# EAGLE design thesis (EAGLE 6.4)
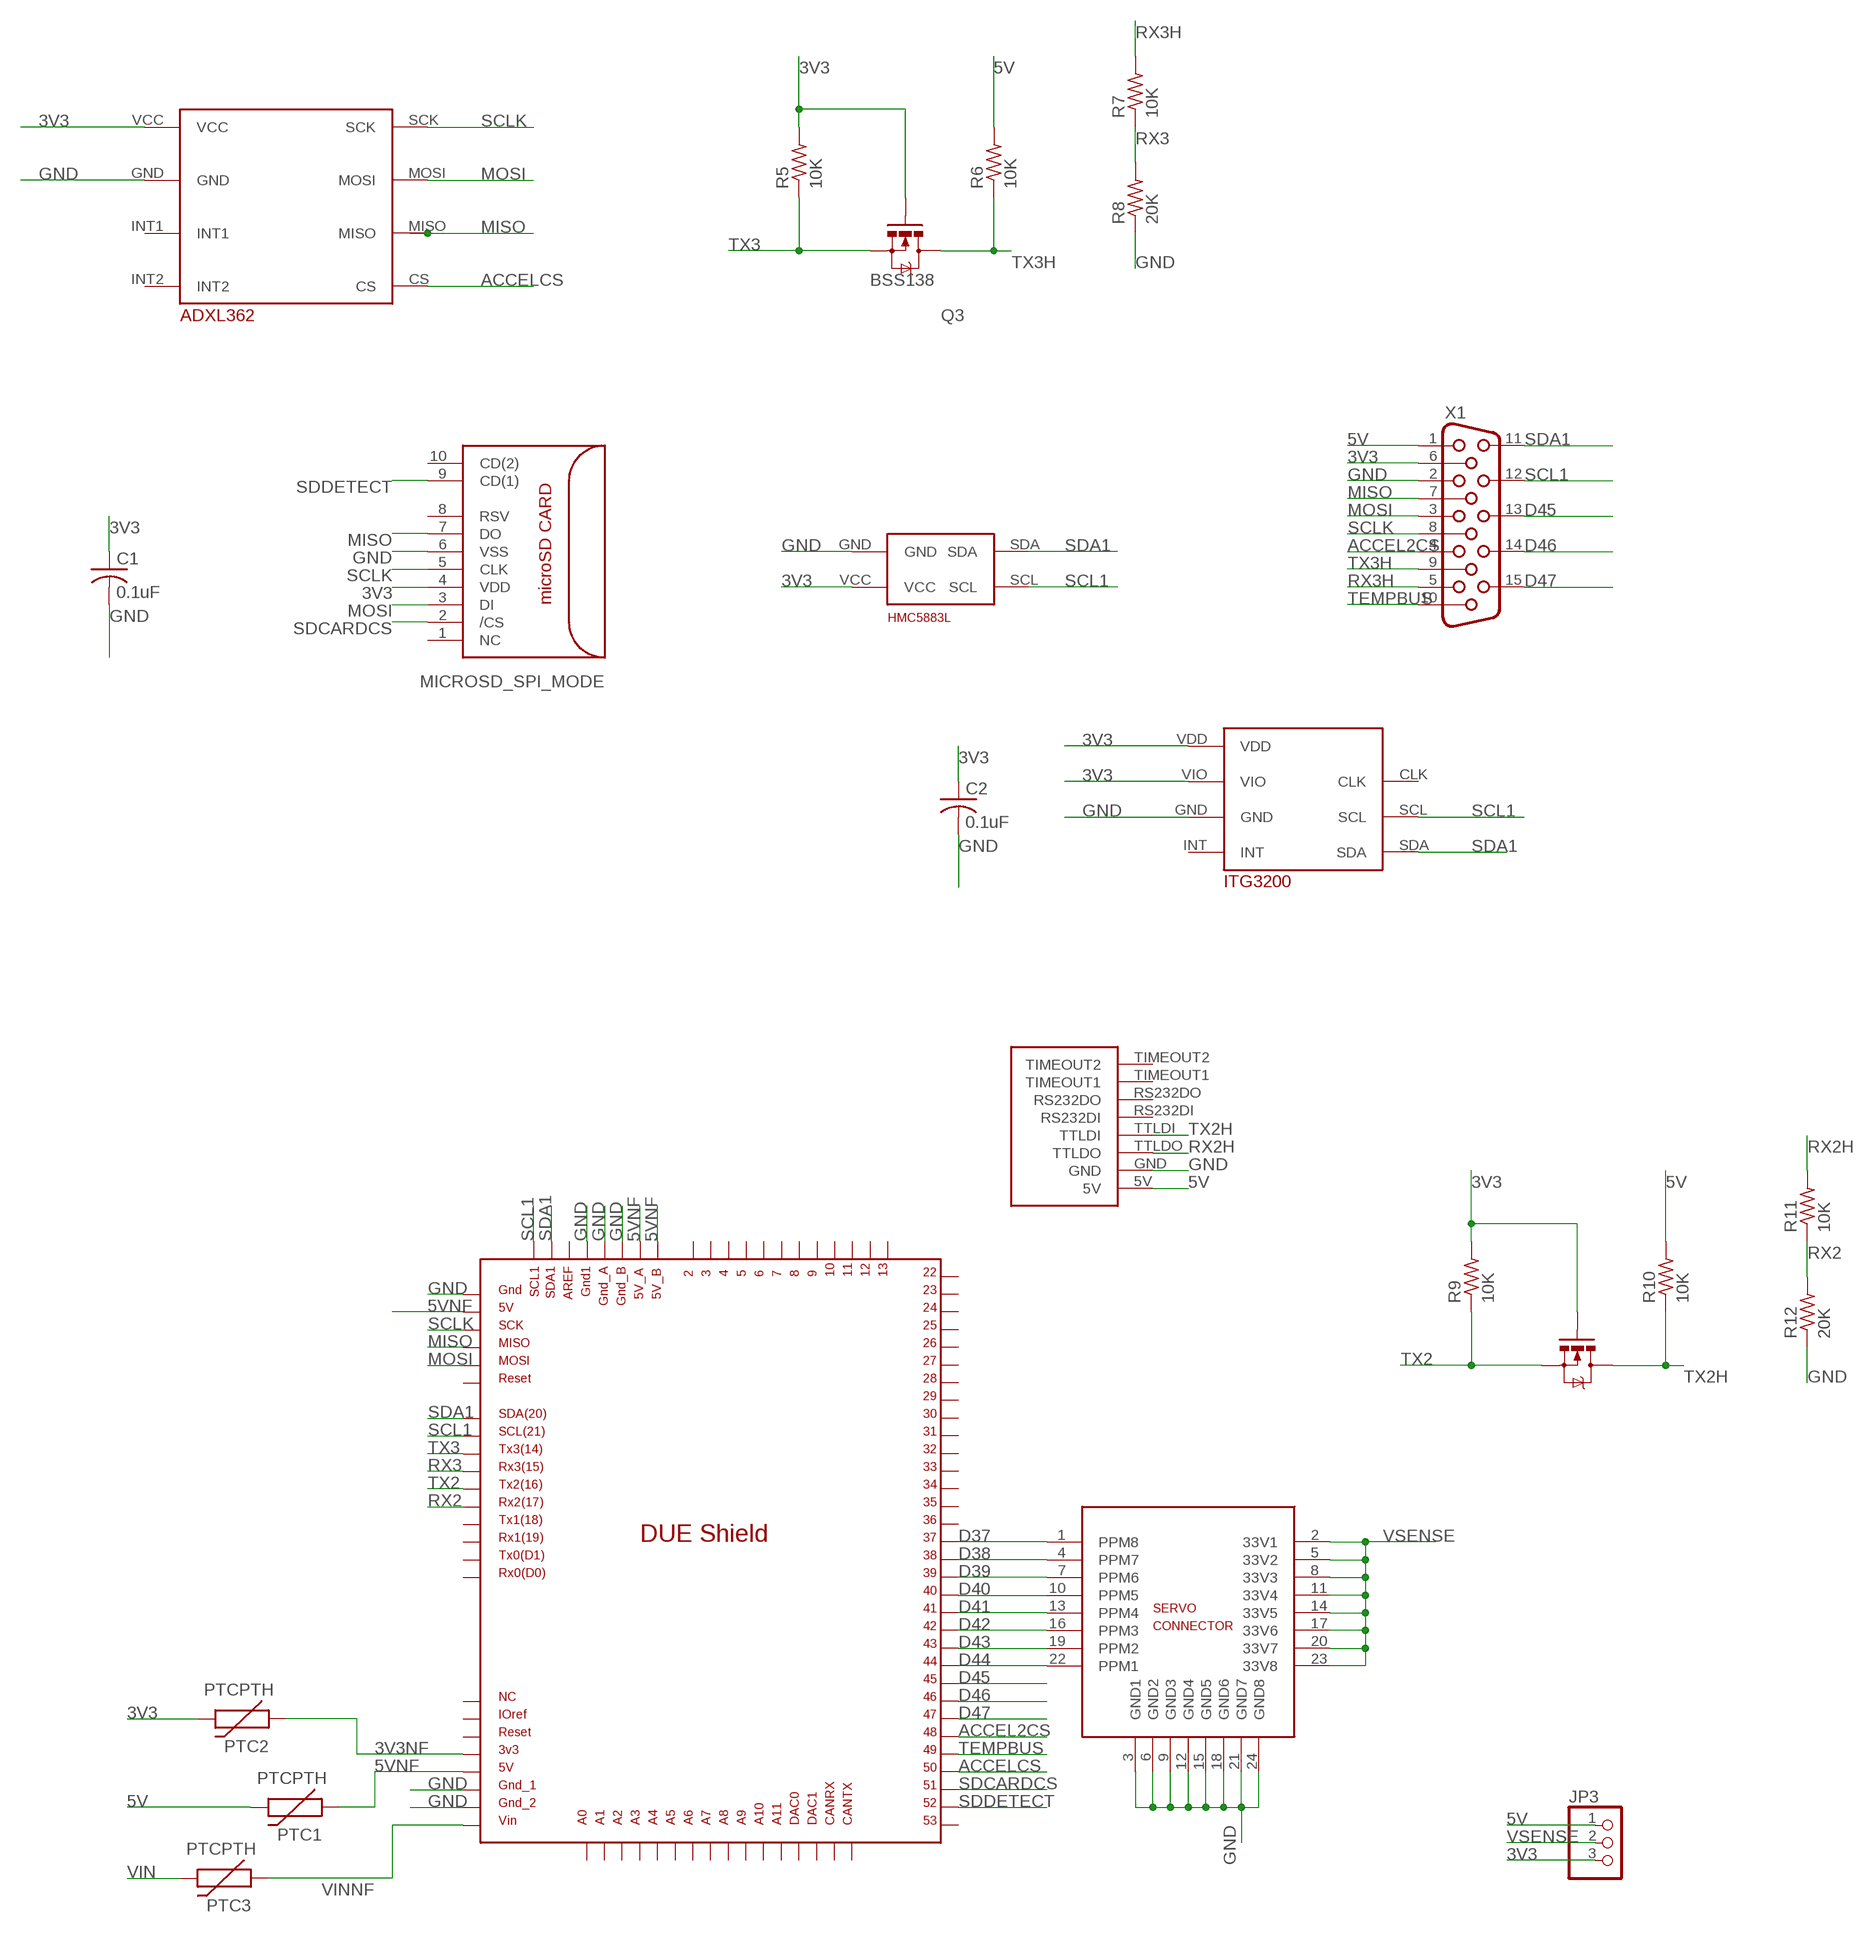
[diagram p0: schematic, sheet 1]

## Parts
C1  0.1uF  C-USC0603  [C0603]
C2  0.1uF  C-USC0603  [C0603]
JP3  PINHD-1X3  [1X03]
PTC1  PTCPTH  [PTC]
PTC2  PTCPTH  [PTC]
PTC3  PTCPTH  [PTC]
Q1  BSS138  MOSFET-NCHANNELBSS123LT1G  [SOT23]
Q3  BSS138  MOSFET-NCHANNELBSS123LT1G  [SOT23]
R5  10K  R-US_R0603  [R0603]
R6  10K  R-US_R0603  [R0603]
R7  10K  R-US_R0603  [R0603]
R8  20K  R-US_R0603  [R0603]
R9  10K  R-US_R0603  [R0603]
R10  10K  R-US_R0603  [R0603]
R11  10K  R-US_R0603  [R0603]
R12  20K  R-US_R0603  [R0603]
U$1  DUE(NORMAL)  [DUE(NORMAL)]
U$2  MICROSD_SPI_MODE  [MICRO_SD_CONNECTOR]
U$4  HMC5883L  [HMC5883L]
U$5  HEADER-3X8SERVO  [3X8RA]
U$6  UBLOXLEA6TBOB  [UBLOXLEA6TBOB]
U$7  ITG3200  [ITG3200]
U$8  ADXL362  [ADXL362]
X1  HF15V  [HDF15V]

## Nets
3V3: C1.1 C2.1 JP3.3 PTC2.P$2 Q1.1(G) Q3.1(G) R5.2 R9.2 U$2.4(VDD) U$4.VCC U$7.VDD U$7.VIO U$8.VCC X1.6
3V3NF: PTC2.P$1 U$1.3V3
5V: JP3.1 PTC1.P$2 R6.2 R10.2 U$6.5V X1.1
5VNF: PTC1.P$1 U$1.5V U$1.5V_A U$1.5V_B U$1.GND_ICSP
ACCEL2CS: U$1.48 X1.4
ACCELCS: U$1.50 U$8.CS
D37: U$1.37 U$5.1(PPM8)
D38: U$1.38 U$5.4(PPM7)
D39: U$1.39 U$5.7(PPM6)
D40: U$1.40 U$5.10(PPM5)
D41: U$1.41 U$5.13(PPM4)
D42: U$1.42 U$5.16(PPM3)
D43: U$1.43 U$5.19(PPM2)
D44: U$1.44 U$5.22(PPM1)
D45: U$1.45 X1.13
D46: U$1.46 X1.14
D47: U$1.47 X1.15
GND: C1.2 C2.2 R8.1 R12.1 U$1.5V_ICSP U$1.GND1 U$1.GND_1 U$1.GND_2 U$1.GND_A U$1.GND_B U$2.6(VSS) U$4.GND U$5.3(GND1) U$5.6(GND2) U$5.9(GND3) U$5.12(GND4) U$5.15(GND5) U$5.18(GND6) U$5.21(GND7) U$5.24(GND8) U$6.GND U$7.GND U$8.GND X1.2
MISO: U$1.MISO_ICSP U$2.7(DO) U$8.MISO X1.7
MOSI: U$1.MOSI_ICSP U$2.3(DI) U$8.MOSI X1.3
RX2: R11.1 R12.2 U$1.RX2
RX2H: R11.2 U$6.TTLDO
RX3: R7.1 R8.2 U$1.RX3
RX3H: R7.2 X1.5
SCL1: U$1.SCL U$1.SCL1 U$4.SCL U$7.SCL X1.12
SCLK: U$1.SCK_ICSP U$2.5(CLK) U$8.SCK X1.8
SDA1: U$1.SDA U$1.SDA1 U$4.SDA U$7.SDA X1.11
SDCARDCS: U$1.51 U$2.2(/CS)
SDDETECT: U$1.52 U$2.9(CD(1))
TEMPBUS: U$1.49 X1.10
TX2: Q1.2(S) R9.1 U$1.TX2
TX2H: Q1.3(D) R10.1 U$6.TTLDI
TX3: Q3.2(S) R5.1 U$1.TX3
TX3H: Q3.3(D) R6.1 X1.9
VIN: PTC3.P$2
VINNF: PTC3.P$1 U$1.VIN
VSENSE: JP3.2 U$5.2(33V1) U$5.5(33V2) U$5.8(33V3) U$5.11(33V4) U$5.14(33V5) U$5.17(33V6) U$5.20(33V7) U$5.23(33V8)
Unconnected: U$1.2 U$1.3 U$1.4 U$1.5 U$1.6 U$1.7 U$1.8 U$1.9 U$1.10 U$1.11 U$1.12 U$1.13 U$1.22 U$1.23 U$1.24 U$1.25 U$1.26 U$1.27 U$1.28 U$1.29 U$1.30 U$1.31 U$1.32 U$1.33 U$1.34 U$1.35 U$1.36 U$1.53 U$1.A0 U$1.A1 U$1.A2 U$1.A3 U$1.A4 U$1.A5 U$1.A6 U$1.A7 U$1.A8 U$1.A9 U$1.A10 U$1.A11 U$1.AREF U$1.CANRX U$1.CANTX U$1.DAC0 U$1.DAC1 U$1.IOREF U$1.NC U$1.RESET U$1.RESET_ICSP U$1.RX0 U$1.RX1 U$1.TX0 U$1.TX1 U$2.1(NC) U$2.8(RSV) U$2.10(CD(2)) U$6.RS232DI U$6.RS232DO U$6.TIMEOUT1 U$6.TIMEOUT2 U$7.CLK U$7.INT U$8.INT1 U$8.INT2

## Library data of the parts
C1 C2 = rcl:C-US: CAPACITOR, American symbol
JP3 = pinhead:PINHD-1X3: PIN HEADER
PTC1-PTC3 = SparkFun-PowerIC:PTC: Resettable Fuse PTC Resettable Fuse. Spark Fun Electronics SKU : COM-08357
Q1 Q3 = SparkFun-DiscreteSemi:MOSFET-NCHANNEL: Common NMOSFET Parts MFG P/N Store ID Prod ID FDD8780 TRANS-09984 SI7820DN TRANS-11055 FDS6630A IC-08089 2N7002PW TRANS-11151 FQP30N06L COM-10213 TRANS-10060 BSS123LT1G TRANS-08345 BSS138 TRANS-00830 BS170 2N7000; PROD_ID: TRANS-08345
R5-R12 = rcl:R-US_: RESISTOR, American symbol
U$1 = DUElib130425:DUE(NORMAL)
U$2 = con-molex-microsd:MICROSD_SPI_MODE: MOLEX - 49225-0821 - CONNECTEUR MICRO SD PUSH/PUSH REV Fabricant: MOLEX Code commande Farnell: 1366700 <http://fr.farnell.com/molex/49225-0821/connecteur-micro-sd-push-push-rev/dp/1366700?Ntt=1366700> Référence fabricant: 49225-0821
U$4 = HMC5883L:HMC5883L
U$5 = pixhawk2:HEADER-3X8
U$6 = csgshop:UBLOXLEA6TBOB
U$7 = ITG3200:ITG3200
U$8 = adxl362:ADXL362
X1 = con-subd:HF15: SUB-D; OC_FARNELL: unknown; OC_NEWARK: unknown

## Board
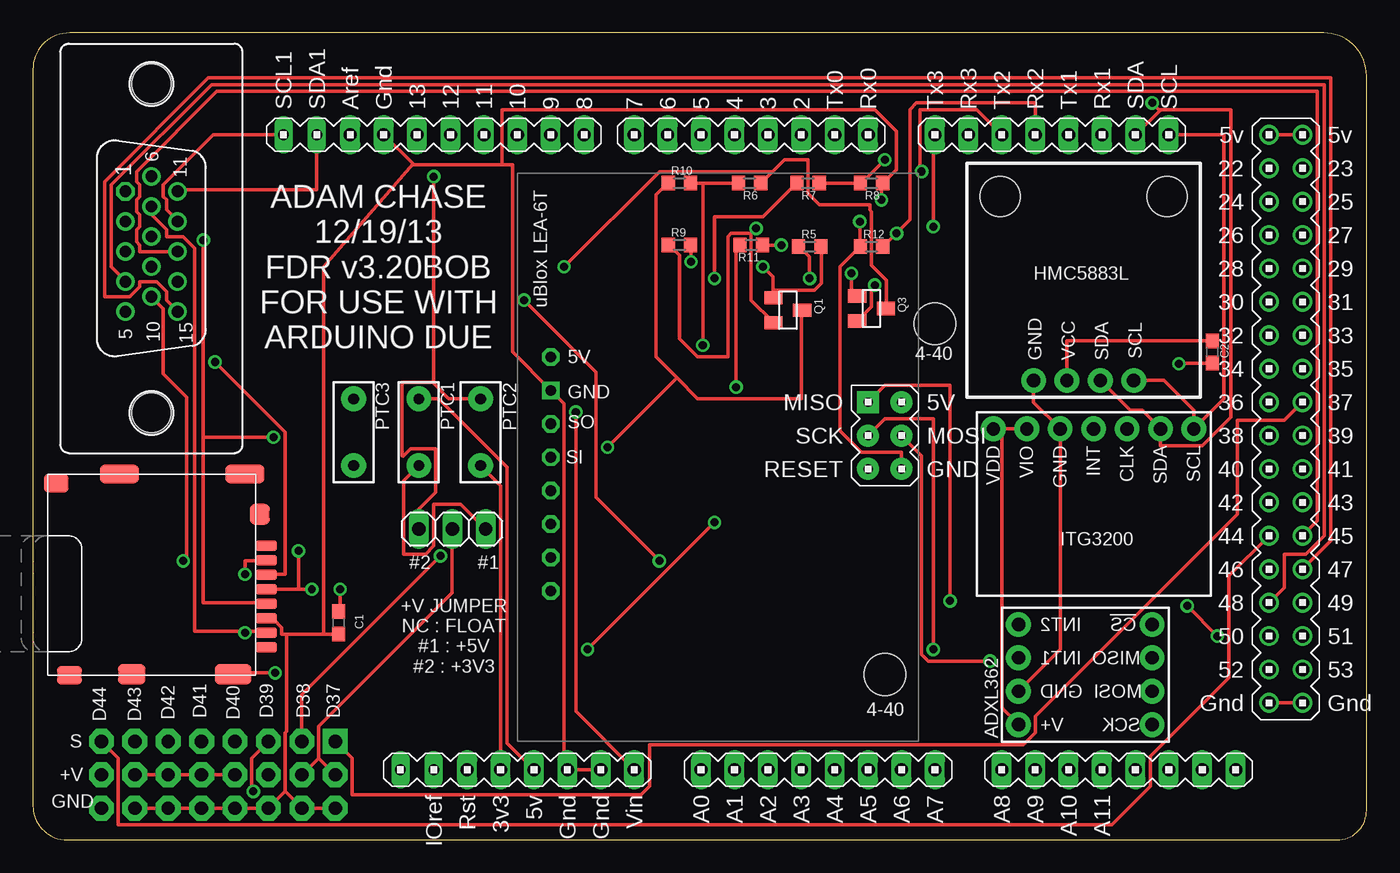
[diagram p1: board, top side]
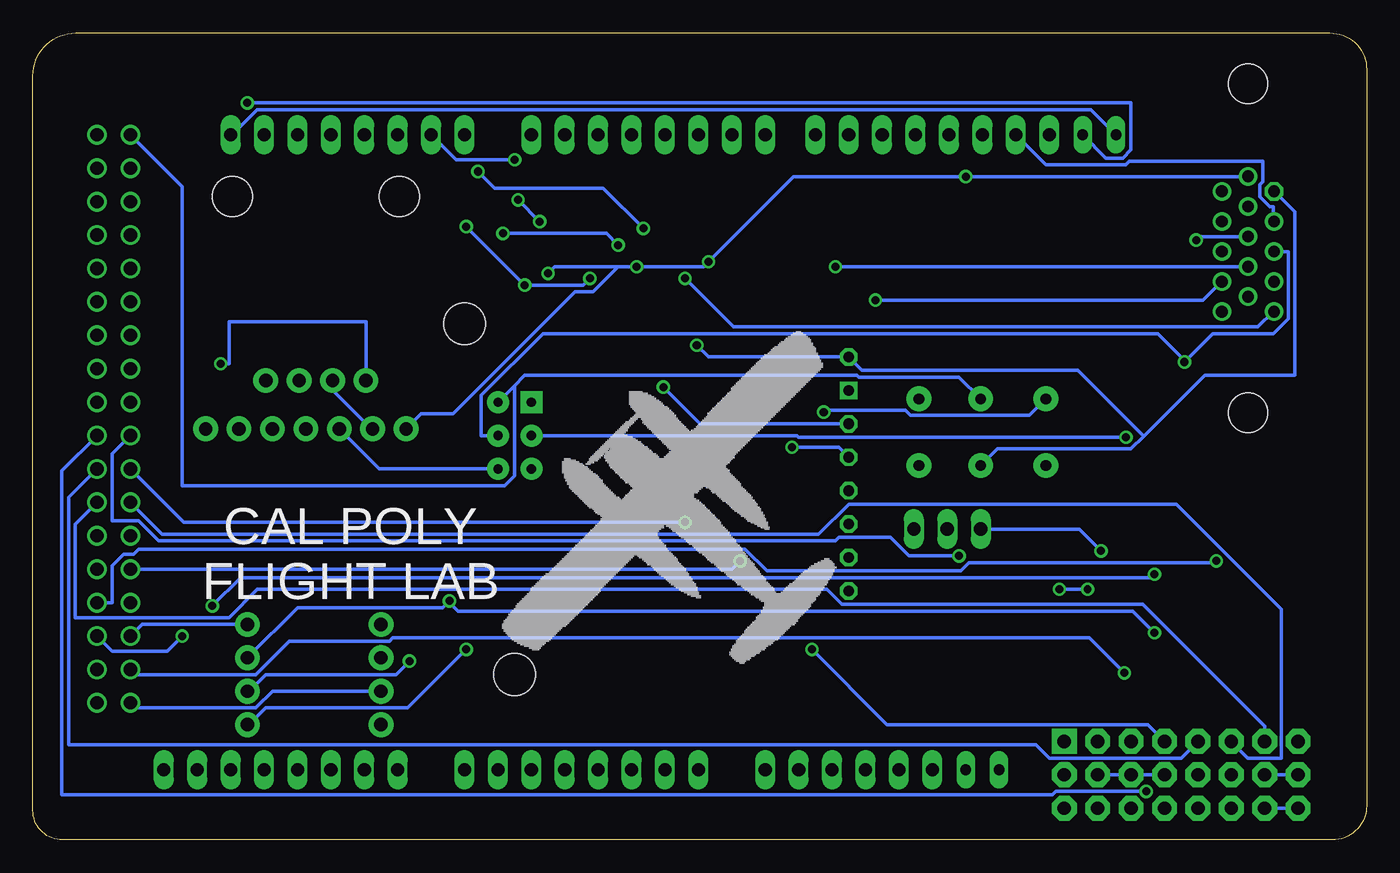
[diagram p2: board, bottom side, seen from below]

Size 101.4 x 61.33 mm. Coordinates in mm from the lower left corner, seen from the top.
Outline: 98.13,61.33 2.79,61.33 arc91 0,58.54 0,2.61 arc90 2.61,0 99.15,0 arc90 101.4,2.25 101.4,58.07 arc90 98.13,61.33
Copper layers (1*16): Top 0.035mm / dielectric 1.5mm / Bottom 0.035mm
Design rules "default": minimum track width 10mil, minimum drill 24mil, track to track 8mil, track to pad 8mil, pad to pad 8mil, via to via 8mil, smd to smd 8mil, copper to edge 40mil, drill to drill 8mil, minimum pad ring 10mil, minimum via ring 8mil, stop-mask expansion 4mil, vias tented up to drill 0mil, thermal gap 10mil
Holes 3.17 mm at 68.58,39.24

### Footprints (pad centres in the part's own frame; a part is rotated, then mirrored left to right if it is on the bottom)
C0603 = smd 1.1 x 1: 1 -0.85,0; 2 0.85,0
1X03 = drill 1.016 long: 1 -2.54,0; 2 0,0; 3 2.54,0
PTC = drill 0.8 pad 1.88: P$1 -2.54,0; P$2 2.54,0
SOT23 = smd 1 x 1.4: 1 -0.95,-1.1; 2 0.95,-1.1; 3 0,1.1
R0603 = smd 1 x 1.1: 1 -0.85,0; 2 0.85,0
DUE(NORMAL) = drill 1 long: 2 -16.51,30.48; 3 -19.05,30.48; 3V3 -39.37,-17.78; 4 -21.59,30.48; 5 -24.13,30.48; 5V -36.83,-17.78; 6 -26.67,30.48; 7 -29.21,30.48; 8 -33.02,30.48; 9 -35.56,30.48; 10 -38.1,30.48; 11 -40.64,30.48; 12 -43.18,30.48; 13 -45.72,30.48; A0 -24.13,-17.78; A1 -21.59,-17.78; A2 -19.05,-17.78; A3 -16.51,-17.78; A4 -13.97,-17.78; A5 -11.43,-17.78; A6 -8.89,-17.78; A7 -6.35,-17.78; A8 -1.27,-17.78; A9 1.27,-17.78; A10 3.81,-17.78; A11 6.35,-17.78; AREF -50.8,30.48; AREF1 -50.8,30.48; CANRX 13.97,-17.78; CANTX 16.51,-17.78; DAC0 8.89,-17.78; DAC1 11.43,-17.78; GND1 -48.26,30.48; GND_1 -34.29,-17.78; GND_2 -31.75,-17.78; RESET -41.91,-17.78; RX0 -11.43,30.48; RX1 6.35,30.48; RX2 1.27,30.48; RX3 -3.81,30.48; SCL 11.43,30.48; SDA 8.89,30.48; TX0 -13.97,30.48; TX1 3.81,30.48; TX2 -1.27,30.48; TX3 -6.35,30.48; VIN -29.21,-17.78 | drill 1: 5V_A 19.05,30.48; 5V_B 21.59,30.48; 22 19.05,27.94; 23 21.59,27.94; 24 19.05,25.4; 25 21.59,25.4; 26 19.05,22.86; 27 21.59,22.86; 28 19.05,20.32; 29 21.59,20.32; 30 19.05,17.78; 31 21.59,17.78; 32 19.05,15.24; 33 21.59,15.24; 34 19.05,12.7; 35 21.59,12.7; 36 19.05,10.16; 37 21.59,10.16; 38 19.05,7.62; 39 21.59,7.62; 40 19.05,5.08; 41 21.59,5.08; 42 19.05,2.54; 43 21.59,2.54; 44 19.05,0; 45 21.59,0; 46 19.05,-2.54; 47 21.59,-2.54; 48 19.05,-5.08; 49 21.59,-5.08; 50 19.05,-7.62; 51 21.59,-7.62; 52 19.05,-10.16; 53 21.59,-10.16; GND_A 19.05,-12.7; GND_B 21.59,-12.7 | drill 0.7 pad 1.676: 5V_ICSP -8.89,5.08; GND_ICSP -8.89,10.16; MOSI_ICSP -8.89,7.62; RESET_ICSP -11.43,5.08; SCK_ICSP -11.43,7.62 | drill 0.8 pad 1.422 long: IOREF -44.45,-17.78; NC -46.99,-17.78; SCL1 -55.88,30.48; SDA1 -53.34,30.48 | drill 0.7 pad 1.676 square: MISO_ICSP -11.43,10.16
MICRO_SD_CONNECTOR = smd 0.8 x 1.6: 1 -2.03,8.2; 2 -0.93,8.2; 3 0.17,8.2; 4 1.27,8.2; 5 2.37,8.2; 6 3.47,8.2; 7 4.57,8.2; 8 5.67,8.2 | smd 1.55 x 2.8: 9 7.735,5.7 | smd 1.55 x 2.1: 10 7.735,-2 | smd 1.4 x 1.9: 11 7.81,-6.75; 12 -6.79,-7.75 | smd 1.4 x 3: 13 -7.49,-2.95; 14 -7.49,6.6 | smd 1.6 x 1.55: 15 -4.43,7.725
HMC5883L = drill 1.016 pad 1.88: GND 5.08,1.27; SCL 12.7,1.27; SDA 10.16,1.27; VCC 7.62,1.27 | hole 3.048: 2.54,15.24; 15.24,15.24
3X8RA = drill 1.016 pad 1.88 square: 1 -1.27,8.89 | drill 1.016 pad 1.88 octagon: 2 1.27,8.89; 3 3.81,8.89; 4 -1.27,6.35; 5 1.27,6.35; 6 3.81,6.35; 7 -1.27,3.81; 8 1.27,3.81; 9 3.81,3.81; 10 -1.27,1.27; 11 1.27,1.27; 12 3.81,1.27; 13 -1.27,-1.27; 14 1.27,-1.27; 15 3.81,-1.27; 16 -1.27,-3.81; 17 1.27,-3.81; 18 3.81,-3.81; 19 -1.27,-6.35; 20 1.27,-6.35; 21 3.81,-6.35; 22 -1.27,-8.89; 23 1.27,-8.89; 24 3.81,-8.89
UBLOXLEA6TBOB = drill 0.813 octagon: 5V 13.97,2.54; RS232DI 24.13,2.54; RS232DO 26.67,2.54; TIMEOUT1 29.21,2.54; TIMEOUT2 31.75,2.54; TTLDI 21.59,2.54; TTLDO 19.05,2.54 | drill 0.813 square: GND 16.51,2.54 | hole 3.175: 38.1,27.94
ITG3200 = drill 1.016 pad 1.88: CLK 11.43,12.7; GND 6.35,12.7; INT 8.89,12.7; SCL 16.51,12.7; SDA 13.97,12.7; VDD 1.27,12.7; VIO 3.81,12.7
ADXL362 = drill 1.016 pad 1.88: CS 1.27,1.27; GND 11.43,6.35; INT1 11.43,3.81; INT2 11.43,1.27; MISO 1.27,3.81; MOSI 1.27,6.35; SCK 1.27,8.89; VCC 11.43,8.89
HDF15V = drill 0.9 octagon: 1 4.329,1.98 | drill 0.9: 2 2.043,1.98; 3 -0.243,1.98; 4 -2.529,1.98; 5 -4.815,1.98; 6 5.472,0; 7 3.186,0; 8 0.9,0; 9 -1.386,0; 10 -3.672,0; 11 4.329,-1.98; 12 2.043,-1.98; 13 -0.243,-1.98; 14 -2.529,-1.98; 15 -4.815,-1.98 | hole 3: -12.5,0; 12.5,0

### Placement (x,y rotation side)
C1  23.24,16.51 270 top
C2  89.66,37.08 270 top
JP3  31.88,23.62 180 top
PTC1  29.34,30.99 270 top
PTC2  34.04,30.99 90 top
PTC3  24.38,30.99 270 top
Q1  57.4,40.26 270 top
Q3  63.75,40.39 270 top
R5  59.05,45.09 0 top
R6  54.48,49.91 180 top
R7  58.93,49.91 180 top
R8  63.75,49.91 180 top
R9  49.15,45.21 0 top
R10  49.15,49.91 0 top
R11  54.61,45.21 180 top
R12  63.75,45.09 0 top
U$1  74.93,23.11 0 top
U$2  9.53,20.32 270 top
U$4  70.99,33.66 0 top
U$5  14.1,6.22 270 top
U$6  36.83,50.67 270 top
U$7  71.75,18.54 0 top
U$8  86.36,17.65 180 top
X1  9.02,44.96 90 top

### Tracks (layer width: path | path; a pad name or v marks a point on that pad's centre or on a via)
3V3  (via drill 0.6, 0.61)
  Top 0.254: JP3.3 29.34,25.15 30.61,26.42 30.61,29.72 28.7,29.72 28.13,29.15 28.07,29.21 28.07,34.8 30.35,34.8 30.42,34.73 | 20.19,19.05 U$2.4 | v20.19,21.97 20.19,19.05 | PTC2.P$2 31.62,33.53 30.42,34.73 | U$7.VIO 73.66,31.24 | U$8.VCC 73.66,10.03 73.66,31.24 | 73.66,31.24 U$7.VDD | v50.04,43.94 50.04,45.21 R9.2 | v55.5,43.56 56.26,42.8 56.26,41.78 | 56.26,41.78 56.26,41.27 Q1.1 | 56.26,41.78 59.44,41.78 59.94,42.29 59.94,45.09 R5.2 | v62.23,43.05 62.23,41.78 62.61,41.4 Q3.1 | v30.48,50.42 30.48,34.8 30.42,34.73 | C2.1 78.61,37.93 U$4.VCC | C1.1 23.37,17.36 v23.37,19.05 | v21.21,19.05 20.19,19.05
  Bottom 0.254: v20.19,21.97 21.84,23.62 JP3.3 | v62.23,43.05 61.72,43.56 56.9,43.56 | 56.9,43.56 v55.5,43.56 50.42,43.56 v50.04,43.94 43.56,50.42 v30.48,50.42 9.02,50.42 X1.6 | U$7.VDD 71.88,32.38 69.47,32.38 60.2,41.66 58.8,41.66 56.9,43.56 | U$7.VIO 75.69,31.24 78.61,34.16 U$4.VCC | v23.37,19.05 v21.21,19.05
3V3NF
  Top 0.254: U$1.3V3 35.56,26.92 PTC2.P$1
5V  (via drill 0.61)
  Top 0.254: R6.2 50.93,49.91 | 50.93,49.91 R10.2 | v50.93,37.59 50.93,49.91 | JP3.1 32.51,25.53 30.48,25.53 30.48,22.35 29.84,21.72 28.19,21.72 28.19,27.3 PTC1.P$2
  Bottom 0.254: v50.93,37.59 50.04,36.7 U$6.5V 38.35,35.69 21.97,35.69 16.95,30.67 | 16.95,30.67 17.91,29.72 28.07,29.72 PTC1.P$2 | 16.95,30.67 12.32,35.31 5.46,35.31 5.46,47.75 6.99,49.28 X1.1
5VNF
  Top 0.254: U$1.5V_B U$1.5V_A | U$1.5V 36.07,7.37 36.07,28.32 30.86,33.53 PTC1.P$1
  Bottom 0.254: 64.83,34.48 64.01,35.31 38.73,35.31 38.61,35.18 30.99,35.18 PTC1.P$1 | 64.83,34.48 U$1.GND_ICSP | U$1.5V_A 90.04,49.66 90.04,26.92 65.53,26.92 64.77,27.69 64.77,34.42 64.83,34.48
ACCEL2CS
  Top 0.254: U$1.48 95.12,19.18 95.12,21.72 96.77,21.72 98.17,23.11 98.17,57.4 13.59,57.4 5.97,49.78 5.97,43.56 6.99,42.55 X1.4
ACCELCS
  Bottom 0.254: U$1.50 93.09,16.38 U$8.CS
D37
  Top 0.254: U$1.37 95.12,31.88 91.57,31.88 91.57,24.77 76.2,9.4 76.2,8.13 75.31,7.24 46.86,7.24 46.86,4.06 46.23,3.43 24.26,3.43 24.26,6.22 U$5.1
D38  (via drill 0.61)
  Top 0.254: v30.99,21.59 20.45,11.05 U$5.4
  Bottom 0.254: U$1.38 95.38,29.34 95.38,24.26 93.34,24.26 91.82,22.73 40.39,22.73 40.13,22.99 36.2,22.99 34.8,21.59 v30.99,21.59
D39  (via drill 0.61)
  Top 0.254: v16.76,3.68 16.64,3.81 16.64,6.22 U$5.7
  Bottom 0.254: U$1.39 99.19,28.07 99.19,3.43 23.88,3.43 23.62,3.68 v16.76,3.68
D40  (via drill 0.61)
  Top 0.254: v42.16,14.48 v51.82,24.13
  Bottom 0.254: U$1.40 89.92,24.13 v51.82,24.13 | v42.16,14.48 36.45,8.76 16.64,8.76 U$5.10
D41
  Bottom 0.254: U$1.41 98.68,26.04 98.68,7.24 25.15,7.24 24.13,6.22 14.1,6.22 U$5.13
D42
  Bottom 0.254: U$1.42 91.57,23.24 41.66,23.24 39.37,25.53 14.48,25.53 6.48,17.53 6.48,6.22 9.02,6.22 U$5.16
D43
  Bottom 0.254: U$1.43 98.17,24 98.17,16.89 86.49,16.89 84.33,19.05 41.02,19.05 39.88,17.91 17.02,17.91 7.75,8.64 U$5.19
D44
  Top 0.254: U$1.44 90.93,20.07 90.93,12.32 84.96,6.35 84.96,4.06 82.04,1.14 6.48,1.14 6.48,6.22 U$5.22
D45
  Top 0.254: U$1.45 97.66,24.26 97.66,56.9 13.97,56.9 7.87,50.8 7.87,50.04 8.13,49.78 8.13,48.9 7.87,48.64 7.87,47.75 8.13,47.5 8.13,46.61 7.87,46.35 7.87,45.47 8.13,45.21 8.13,44.7 10.92,44.7 X1.13
D46  (via drill 0.61)
  Top 0.254: v37.34,41.02 42.8,35.56 42.8,26.04 v47.62,21.21
  Bottom 0.254: v37.34,41.02 12.45,41.02 11.05,42.42 X1.14 | v47.62,21.21 48.26,20.57 U$1.46
D47
  Top 0.254: U$1.47 98.68,22.73 98.68,57.91 13.34,57.91 5.46,50.04 5.46,41.27 7.37,41.27 8.13,42.04 8.13,42.42 9.4,42.42 10.16,41.66 10.16,41.02 10.92,40.26 X1.15
GND  (via drill 0.6, 0.61)
  Top 0.254: 62.87,45.09 61.34,43.56 61.34,31.11 62.99,29.46 66.04,29.46 U$1.5V_ICSP | v64.52,48.64 64.52,49.91 R8.1 64.64,49.91 65.66,50.93 65.66,53.85 64.01,55.5 35.69,55.5 35.69,51.31 | 62.87,45.09 v62.87,46.99 | 62.87,45.09 R12.1 | U$1.GND_B U$1.GND_A | U$8.GND 78.11,14.48 U$7.GND 76.07,33.27 U$4.GND | U$5.21 U$5.18 U$5.15 U$5.12 U$5.9 19.18,3.68 | 19.3,15.62 18.92,15.62 18.92,16.13 18.29,16.76 17.78,16.76 U$2.6 | 19.3,15.62 21.97,15.62 22.1,15.62 | 19.3,15.62 19.3,8.26 19.18,8.13 19.18,3.68 | 19.18,3.68 U$5.6 U$5.3 | U$1.GND_2 U$1.GND_1 40.39,5.59 40.39,33.15 U$6.GND 36.45,37.08 36.45,51.31 35.69,51.31 | 28.89,51.37 28.96,51.31 35.69,51.31 | 28.89,51.37 U$1.GND1 | 22.1,15.62 22.1,43.56 28.89,51.37 | C2.2 87.63,36.23 v87.12,36.2 | 22.1,15.62 23.24,15.62 C1.2
  Bottom 0.254: v62.87,46.99 v64.52,48.64 | U$1.GND_A 93.6,10.03 84.45,10.03 83.19,11.3 U$8.GND | U$1.5V_ICSP 75.06,28.19 U$7.GND | U$5.21 U$5.24 | U$1.GND1 24.38,51.31 18.29,51.31 18.03,51.56 7.87,51.56 7.87,50.04 8.13,49.78 8.13,48.9 7.37,48.13 7.11,48.13 7.11,47.12 X1.2 | v87.12,36.2 86.49,36.2 86.49,39.37 76.07,39.37 U$4.GND
MISO  (via drill 0.61)
  Top 0.254: 16.13,15.88 12.32,15.88 12.32,44.96 11.43,45.85 10.16,45.85 10.16,46.35 9.02,47.5 X1.7 | 16.13,15.88 17.65,15.88 U$2.7 | U$1.MISO_ICSP 64.77,34.54 69.72,34.54 v69.72,18.16 | v16.13,15.75 16.13,15.88
  Bottom 0.254: U$8.MISO 81.28,17.65 70.23,17.65 v69.72,18.16 69.72,18.03 69.09,17.4 17.78,17.4 v16.13,15.75
MOSI  (via drill 0.61)
  Top 0.254: v13.84,36.32 19.18,30.99 19.18,20.19 17.78,20.19 U$2.3 | U$1.MOSI_ICSP 67.56,29.21 67.56,14.1 68.07,13.59 v72.77,13.59
  Bottom 0.254: X1.3 6.99,44.7 5.97,44.7 5.97,39.62 7.11,38.48 11.68,38.48 v13.84,36.32 13.84,36.45 15.88,38.48 62.61,38.48 67.31,33.78 67.31,30.73 U$1.MOSI_ICSP | v72.77,13.59 73.79,12.57 83.69,12.57 84.96,11.3 U$8.MOSI
RX2  (via drill 0.61)
  Top 0.254: U$1.RX2 76.2,56.01 67.18,56.01 66.67,55.5 66.67,47.12 v65.66,46.1 64.64,45.09 R12.2 | v56.9,45.21 R11.1
  Bottom 0.254: v56.9,45.21 57.78,46.1 v65.66,46.1
RX2H  (via drill 0.61)
  Top 0.254: v53.47,34.42 53.47,44.96 53.72,45.21 R11.2
  Bottom 0.254: v53.47,34.42 50.67,31.62 U$6.TTLDO
RX3  (via drill 0.61)
  Top 0.254: R7.1 R8.2 62.99,49.91 v64.77,51.69
  Bottom 0.254: v64.77,51.69 69.22,51.69 U$1.RX3
RX3H  (via drill 0.61)
  Top 0.254: v51.82,42.67 51.82,47.37 55.5,47.37 58.04,49.91 R7.2
  Bottom 0.254: v51.82,42.67 48.13,38.99 8.26,38.99 7.11,40.13 X1.5
SCL1
  Top 0.254: U$1.SCL1 13.72,53.59 9.91,49.78 9.91,48.9 10.16,48.64 10.16,47.88 10.92,47.12 X1.12 | U$1.SCL 90.55,53.59 90.55,33.53 U$7.SCL 88.27,32.64 85.98,34.92 U$4.SCL
  Bottom 0.254: U$1.SCL1 20.95,55.5 84.33,55.5 86.23,53.59 U$1.SCL
SCLK  (via drill 0.61)
  Top 0.254: v12.95,45.59 12.95,30.61 | 12.95,30.61 12.95,18.03 17.65,18.03 U$2.5 | U$1.SCK_ICSP 64.77,32 68.45,32 v68.45,14.48 | v18.29,30.61 12.95,30.61
  Bottom 0.254: v12.95,45.59 12.7,45.85 9.02,45.85 X1.8 | v68.45,14.48 72.9,10.03 83.69,10.03 84.96,8.76 U$8.SCK | v18.29,30.61 43.18,30.61 43.31,30.73 U$1.SCK_ICSP
SDA1  (via drill 0.61)
  Top 0.254: U$1.SDA1 21.59,49.4 11.05,49.4 X1.11 | 85.66,55.44 85.72,55.5 91.06,55.5 91.06,32.13 88.9,29.97 85.72,29.97 U$7.SDA 84.33,32.64 83.44,32.64 U$4.SDA | 85.66,55.44 U$1.SDA | 85.66,55.44 v85.09,56.01
  Bottom 0.254: U$1.SDA1 19.81,51.82 18.54,51.82 17.91,52.45 17.91,56.01 v85.09,56.01
SDCARDCS  (via drill 0.61)
  Top 0.254: v16.13,20.19 16.13,21.21 17.65,21.21 U$2.2 | v90.04,15.49 v87.76,17.78
  Bottom 0.254: v16.13,20.19 16.38,19.94 85.6,19.94 v87.76,17.78 | v90.04,15.49 91.19,14.35 95.38,14.35 U$1.51
SDDETECT  (via drill 0.61)
  Top 0.254: v18.41,12.7 15.24,12.7 U$2.9
  Bottom 0.254: v18.41,12.7 21.08,15.37 74.04,15.37 74.3,15.11 81.92,15.11 84.45,12.57 93.6,12.57 U$1.52
TEMPBUS  (via drill 0.61)
  Top 0.254: v11.43,21.21 11.68,21.46 11.68,33.66 9.91,35.43 9.91,40.39 9.02,41.27 X1.10
  Bottom 0.254: v11.43,21.21 11.56,21.08 30.23,21.08 30.86,20.45 45.59,20.45 47.24,22.1 93.34,22.1 93.73,21.72 94.49,21.72 95.38,20.83 95.38,18.03 U$1.49
TX2  (via drill 0.61)
  Top 0.254: 54.61,46.1 53.09,46.1 52.83,45.85 52.83,36.7 50.55,36.7 49.15,38.1 49.15,44.45 48.39,45.21 R9.1 | 54.61,46.1 54.61,41.02 56.26,39.37 Q1.2 | U$1.TX2 71.75,55.5 67.44,55.5 67.44,50.93 v67.56,50.8 | 54.61,46.1 v54.99,46.48
  Bottom 0.254: v67.56,50.8 66.29,49.53 58.04,49.53 v54.99,46.48
TX2H  (via drill 0.61)
  Top 0.254: 48.96,35.12 50.55,33.53 58.42,33.53 58.42,40.26 Q1.3 | 48.96,35.12 47.37,36.7 47.37,49.02 48.26,49.91 R10.1 | 48.96,35.12 v43.69,29.84
  Bottom 0.254: U$6.TTLDI 40.13,29.84 v43.69,29.84
TX3  (via drill 0.61)
  Top 0.254: v59.05,42.67 59.05,44.32 58.29,45.09 R5.1 | v64.01,42.16 63.75,41.91 63.75,40.51 62.74,39.5 Q3.2 | U$1.TX3 68.45,53.47 v68.45,46.61
  Bottom 0.254: v59.05,42.67 59.56,42.16 v64.01,42.16 v68.45,46.61
TX3H  (via drill 0.61)
  Top 0.254: 56.2,50.74 57.15,51.69 58.93,51.69 58.93,49.15 59.82,48.26 63.63,48.26 63.63,47.88 63.75,47.75 63.75,43.69 64.9,42.55 64.9,40.39 Q3.3 | 56.2,50.74 55.37,49.91 R6.1 | v40.39,43.56 47.62,50.8 56.13,50.8 56.2,50.74
  Bottom 0.254: v40.39,43.56 X1.9
VINNF  (via drill 0.61)
  Top 0.254: U$1.VIN 41.27,9.78 v41.27,32.51
  Bottom 0.254: v41.27,32.51 41.15,32.64 35.05,32.64 34.67,32.26 25.65,32.26 PTC3.P$1
VSENSE
  Top 0.254: U$5.20 U$5.17 U$5.14 U$5.11 | JP3.2 31.88,18.8 21.72,8.64 21.72,6.22 | U$5.5 21.72,6.22 | 21.72,6.22 U$5.2
  Bottom 0.254: U$5.20 U$5.23 | U$5.11 U$5.8 U$5.5

### Text on the board
tPlace: ADAM CHASE / 12/19/13 / FDR v3.20BOB / FOR USE WITH / ARDUINO DUE | 5V | 4-40 | GND | SO | SI | #2 | #1 | +V JUMPER / NC : FLOAT / #1 : +5V / #2 : +3V3 | D44 | D43 | D42 | D41 | D40 | D39 | D38 | D37 | 4-40 | S | +V | GND
bPlace: CAL POLY / FLIGHT LAB